# Altium project ECE Modules ECAD.PrjPcb
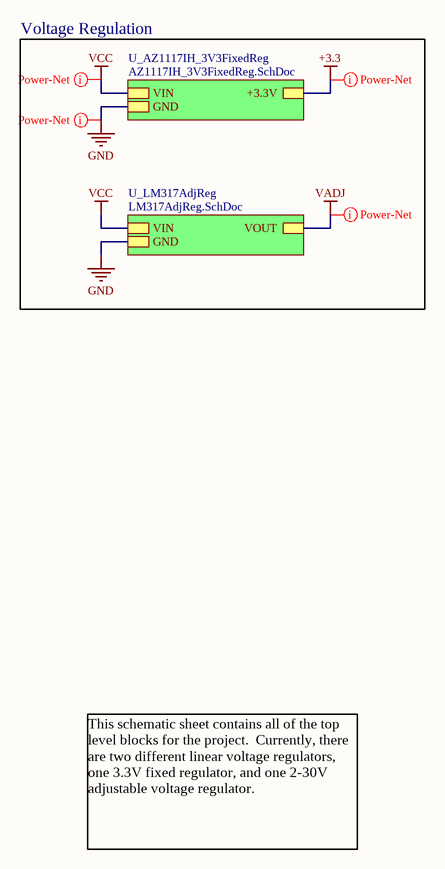
[diagram p0: Top Level.SchDoc]
3 sheets, 16 parts. Net scope: hierarchical (ports join the sheet entries above them; power ports are global).
Sheets:
  Top Level.SchDoc
    U_LM317AdjReg = LM317AdjReg.SchDoc
    U_AZ1117IH_3V3FixedReg = AZ1117IH_3V3FixedReg.SchDoc

## Sheet Top Level.SchDoc: Top Level Schematic
size A; DrawnBy: LSG; SheetNumber: 1; SheetTotal: 3

### Sub-sheets
U_AZ1117IH_3V3FixedReg = AZ1117IH_3V3FixedReg.SchDoc: VIN, +3.3V, GND
U_LM317AdjReg = LM317AdjReg.SchDoc: VIN, VOUT, GND

### Nets
GND: sheet U_LM317AdjReg/GND, sheet U_AZ1117IH_3V3FixedReg/GND
VCC: sheet U_LM317AdjReg/VIN, sheet U_AZ1117IH_3V3FixedReg/VIN

### Layout directives
net class Power-Net: +3.3, GND, VADJ, VCC

### Notes on the sheet
- Voltage Regulation
- This schematic sheet contains all of the top level blocks for the project.  Currently, there are two different linear voltage regulators, one 3.3V fixed regulator, and one 2-30V adjustable voltage regulator.

## Sheet LM317AdjReg.SchDoc: LM317 Adjustable Linear Voltage Regulator
size A; DrawnBy: LSG; SheetNumber: 2; SheetTotal: 3
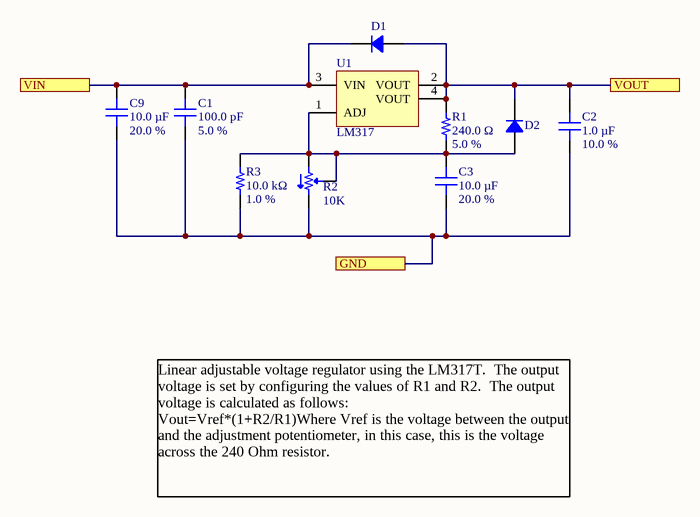
[diagram p1: LM317AdjReg.SchDoc]

### Parts
C1  100.0 pF  Tolerance: 5.0 %  [PCB - CAPACITOR - MLCC - CAP 0603_1608]
C2  1.0 µF  Tolerance: 10.0 %  [PCB - CAPACITOR - MLCC - CAP 0603_1608]
C3  10.0 µF  Tolerance: 20.0 %  [PCB - CAPACITOR - MLCC - CAP 0603_1608]
C9  10.0 µF  Tolerance: 20.0 %  [PCB - CAPACITOR - MLCC - CAP 0603_1608]
D1  CDSU4148  [PCB - DIODES - SOD523F]  (value not drawn)
D2  CDSU4148  [PCB - DIODES - SOD523F]  (value not drawn)
R1  240.0 Ω  Tolerance: 5.0 %  [PCB - RESISTOR - AXIAL]
R2  10K  [TrimmerPot]
R3  10.0 kΩ  Tolerance: 1.0 %  [PCB - RESISTOR - CHIP - RES 0603_1608]
U1  LM317  [PCB - LEADED - SOT - SOT-223]

### Ports
GND, VIN, VOUT

### Nets
GND: C1.1 C2.1 C3.1 C9.1 R2.3 R3.1 ; port GND
VADJ: C2.2 D1.1 D2.2 R1.2 U1.2(VOUT) U1.4(VOUT) ; port VOUT
VCC: C1.2 C9.2 D1.2 U1.3(VIN) ; port VIN
NetC3_2: C3.2 D2.1 R1.1 R2.1 R2.2 R3.2 U1.1(ADJ)

### Notes on the sheet
- Linear adjustable voltage regulator using the LM317T.  The output voltage is set by configuring the values of R1 and R2.  The output voltage is calculated as follows:
  Vout=Vref*(1+R2/R1)Where Vref is the voltage between the output and the adjustment potentiometer, in this case, this is the voltage across the 240 Ohm resistor.

### Library data of the parts
C1 = 1535: 100 pF ±5% 50V Ceramic Capacitor X7R 0603 (1608 Metric); Rowan Part Number: 1535; Manufacturer: YAGEO; Manufacturer part number: CC0603JRX7R9BB101; Name: 100.0 pF 50.0 V 5.0 % Ceramic Capacitor; Voltage Rating: 50.0 V; Supplier 1: Digi-Key; Supplier Part Number 1: 311-4003-2-ND; Category: Capacitors; Datasheet: https://www.yageo.com/upload/media/product/productsearch/datasheet/mlcc/UPY-GPHC_X7R_6.3V-to-50V_20.pdf; Status: Active; Package: 0603 (1608 Metric); Packaging: Tape & Reel (TR); Composition: Ceramic; Capacitance: 100.0 pF
C2 = 1552: 1 µF ±10% 25V Ceramic Capacitor X7R 0603 (1608 Metric); Rowan Part Number: 1552; Manufacturer: YAGEO; Manufacturer part number: CC0603KRX7R8BB105; Name: 1.0 µF 25.0 V 10.0 % Ceramic Capacitor; Voltage Rating: 25.0 V; Supplier 1: Digi-Key; Supplier Part Number 1: 311-1802-2-ND; Category: Capacitors; Datasheet: https://www.yageo.com/upload/media/product/productsearch/datasheet/mlcc/UPY-GPHC_X7R_6.3V-to-50V_20.pdf; Status: Active; Package: 0603 (1608 Metric); Packaging: Tape & Reel (TR); Composition: Ceramic; Capacitance: 1.0 µF
C3 C9 = 1572: 10 µF ±20% 16V Ceramic Capacitor X5R 0603 (1608 Metric); Rowan Part Number: 1572; Manufacturer: YAGEO; Manufacturer part number: CC0603MRX5R7BB106; Name: 10.0 µF 16.0 V 20.0 % Ceramic Capacitor; Voltage Rating: 16.0 V; Supplier 1: Digi-Key; Supplier Part Number 1: 311-1822-2-ND; Category: Capacitors; Datasheet: https://www.yageo.com/upload/media/product/productsearch/datasheet/mlcc/UPY-GPHC_X5R_4V-to-50V_26.pdf; Status: Active; Package: 0603 (1608 Metric); Packaging: Tape & Reel (TR); Composition: Ceramic; Capacitance: 10.0 µF
D1 D2 = 1611: Diode Standard 75 V 150mA Surface Mount 0603/SOD-523F; Rowan Part Number: 1611; Manufacturer: Comchip Technology; Name: CDSU4148 - Standard Diode; Voltage - Forward: 1 V @ 50 mA; Voltage - DC Reverse: 75 V; Manufacturer part number: CDSU4148; Supplier 1: Digi-Key; Supplier Part Number 1: 641-1001-2-ND; Category: Rectifier Diodes; Datasheet: https://www.comchiptech.com/admin/files/product/CDSU4148-HF-RevC216291.pdf; Status: Active; Package: 2-SMD, No Lead; Packaging: Tape & Reel (TR); Mounting Type: Surface Mount; Current - Average Rectified: 150mA; Base Part Number: CDSU4148; Diode Type: Standard
R1 = 57: 240 Ohms ±5% 0.25W, 1/4W Through Hole Resistor Axial  Carbon Film; Rowan Part Number: 57; Manufacturer: Yageo; Manufacturer part number: CFR-25JB-52-240R; Name: 240.0 Ω 250.0 mW 5.0 % Carbon Film Resistor; Power: 250.0 mW; Supplier 1: Digi-Key; Supplier Part Number 1: 240QBK-ND; Category: Fixed; Datasheet: https://www.yageo.com/upload/media/product/products/datasheet/lr/Yageo_LR_CFR_1.pdf; Status: Active; Package: Axial; Resistance: 240.0 Ω; Packaging: Bulk; Composition: Carbon Film
R2 = Potentiometer: Rowan Part Number: 1349; Value: 10K
R3 = 1416: 10 kOhms ±1% 0.1W, 1/10W Chip Resistor 0603 (1608 Metric) Moisture Resistant Thick Film; Rowan Part Number: 1416; Manufacturer: Yageo; Manufacturer part number: RC0603FR-0710KL; Name: 10.0 kΩ 100.0 mW 1.0 % Thick Film Resistor; Power: 100.0 mW; Supplier 1: Digi-Key; Supplier Part Number 1: 311-10.0KHRTR-ND; Category: Fixed; Datasheet: https://www.yageo.com/upload/media/product/productsearch/datasheet/rchip/PYu-RC_Group_51_RoHS_L_11.pdf; Status: Active; Composition: Thick Film; Resistance: 10.0 kΩ; Packaging: Tape & Reel (TR); Package: 0603 (1608 Metric)
U1 = 1613: Linear Voltage Regulator IC Positive Adjustable 1 Output 1.5A SOT-223-4; Rowan Part Number: 1613; Manufacturer: Texas Instruments; Manufacturer part number: LM317DCYR; Name: LM317 - 1.25V ―; Voltage - Output (Min or Fixed): 1.25V; Voltage - Output (Max): 37V; Voltage - Input (Max): 40V; Supplier 1: Digi-Key; Supplier Part Number 1: 296-12602-2-ND; Category: Linear Regulators; Datasheet: https://rocelec.widen.net/view/pdf/mlzstqhekh/slvs044x.pdf?t.download=true&amp;u=5oefqw; Status: Active; Package: TO-261-4, TO-261AA; Dropout Voltage: -; Output Current: 1.5A; Output Type: Adjustable; Output Configuration: Positive; Packaging: Tape & Reel (TR); Base Part Number: LM317

## Sheet AZ1117IH_3V3FixedReg.SchDoc: AZ1117IH 3.3V Linear Voltage Regulator
size A; DrawnBy: LSG; SheetNumber: 3; SheetTotal: 3
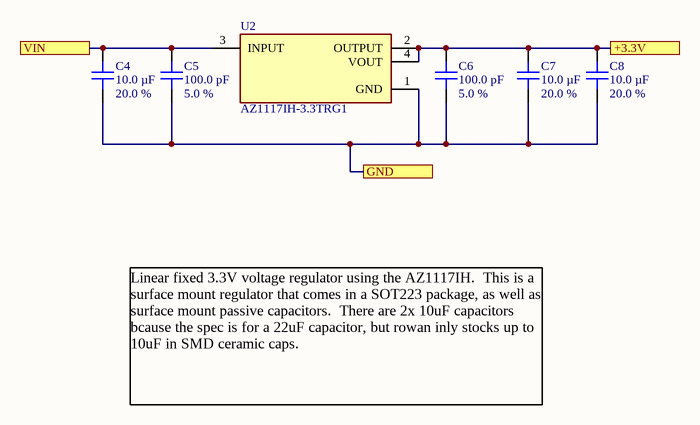
[diagram p2: AZ1117IH_3V3FixedReg.SchDoc]

### Parts
C4  10.0 µF  Tolerance: 20.0 %  [PCB - CAPACITOR - MLCC - CAP 0603_1608]
C5  100.0 pF  Tolerance: 5.0 %  [PCB - CAPACITOR - MLCC - CAP 0603_1608]
C6  100.0 pF  Tolerance: 5.0 %  [PCB - CAPACITOR - MLCC - CAP 0603_1608]
C7  10.0 µF  Tolerance: 20.0 %  [PCB - CAPACITOR - MLCC - CAP 0603_1608]
C8  10.0 µF  Tolerance: 20.0 %  [PCB - CAPACITOR - MLCC - CAP 0603_1608]
U2  AZ1117IH-3.3TRG1  [FP-SOT223-MFG]

### Ports
+3.3V, GND, VIN

### Nets
+3.3: C6.2 C7.2 C8.2 U2.2(OUTPUT) U2.4(VOUT) ; port +3.3V
GND: C4.1 C5.1 C6.1 C7.1 C8.1 U2.1(GND) ; port GND
VCC: C4.2 C5.2 U2.3(INPUT) ; port VIN

### Notes on the sheet
- Linear fixed 3.3V voltage regulator using the AZ1117IH.  This is a surface mount regulator that comes in a SOT223 package, as well as surface mount passive capacitors.  There are 2x 10uF capacitors bcause the spec is for a 22uF capacitor, but rowan inly stocks up to 10uF in SMD ceramic caps.

### Library data of the parts
C4 C7 C8 = 1572: as C3 on sheet LM317AdjReg; Supplier 1: Digi-Key; Supplier Part Number 1: 311-1822-2-ND; Category: Capacitors; Datasheet: https://www.yageo.com/upload/media/product/productsearch/datasheet/mlcc/UPY-GPHC_X5R_4V-to-50V_26.pdf; Status: Active; Package: 0603 (1608 Metric); Packaging: Tape & Reel (TR); Composition: Ceramic; Capacitance: 10.0 µF
C5 C6 = 1535: as C1 on sheet LM317AdjReg; Supplier 1: Digi-Key; Supplier Part Number 1: 311-4003-2-ND; Category: Capacitors; Datasheet: https://www.yageo.com/upload/media/product/productsearch/datasheet/mlcc/UPY-GPHC_X7R_6.3V-to-50V_20.pdf; Status: Active; Package: 0603 (1608 Metric); Packaging: Tape & Reel (TR); Composition: Ceramic; Capacitance: 100.0 pF
U2 = CMP-12756-000043-1: IC REG LINEAR 3.3V 1A SOT223; Output Current: 800mA; Number of Regulators: 1; Dropout Voltage: 1.2V; RoHS Compliant: Yes; Min Current Limit: 1A; Mount: Surface Mount; Packaging: Tape and Reel; Output Voltage: 3.3V; Min Operating Temperature: -40°C; Max Operating Temperature: 125°C; Number of Pins: 3; Case/Package: TO-261-4

## Nets that join several sheets
GND: LM317AdjReg (6 pins), AZ1117IH_3V3FixedReg (6 pins)
VCC: LM317AdjReg (C1.2 C9.2 D1.2 U1.3), AZ1117IH_3V3FixedReg (C4.2 C5.2 U2.3)